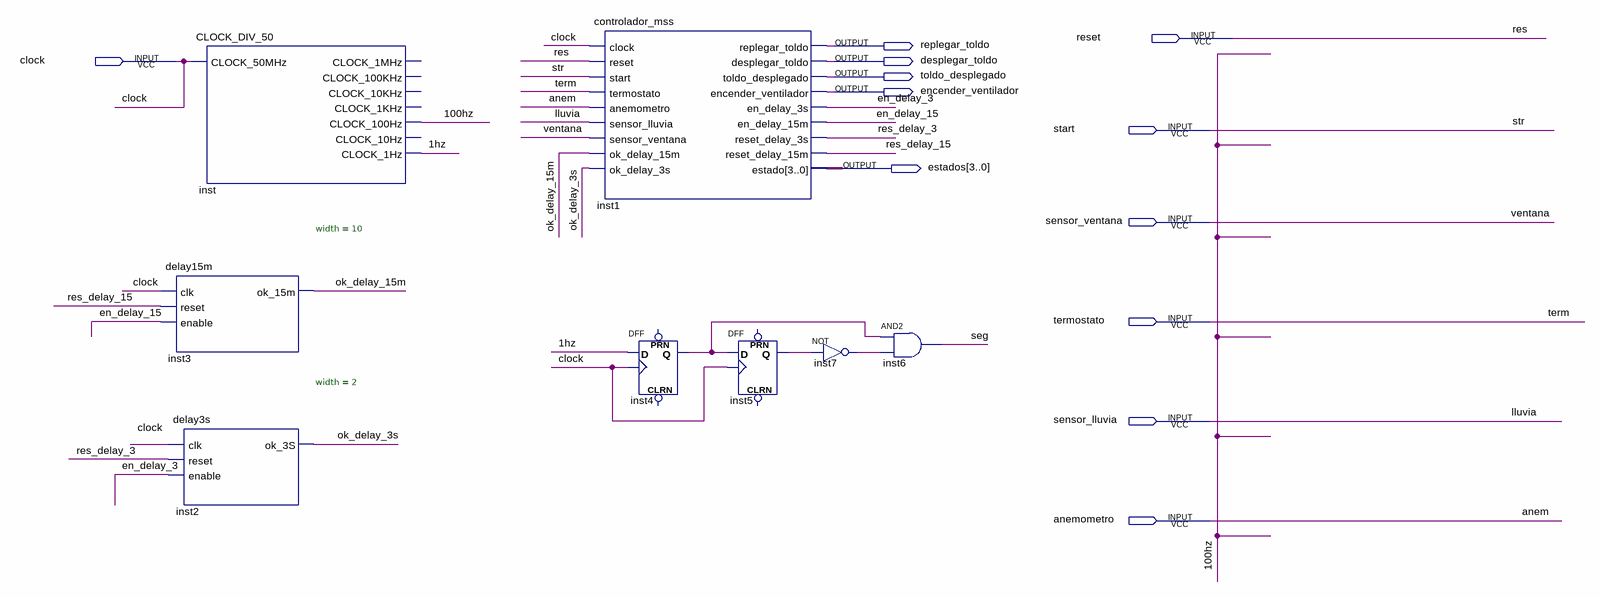
[diagram p0: schematic sheet]
// Quartus schematic domotico.bdf as structural Verilog: 8 symbols, 12 pins
module domotico (
  input  reset,
  input  clock,
  input  start,
  input  sensor_ventana,
  input  termostato,
  input  sensor_lluvia,
  input  anemometro,
  output replegar_toldo,
  output desplegar_toldo,
  output toldo_desplegado,
  output encender_ventilador,
  output [3:0] estados
);

  wire \1hz , \100hz , en_delay_3, en_delay_15, inst4_q, inst5_q, inst7_out, ok_delay_3s, ok_delay_15m,
       res_delay_3, res_delay_15, seg;

  CLOCK_DIV_50 inst (
    .CLOCK_50MHz(clock), .CLOCK_100Hz(\100hz ), .CLOCK_1Hz(\1hz ));  // open: CLOCK_1MHz, CLOCK_100KHz, CLOCK_10KHz, CLOCK_1KHz, CLOCK_10Hz
  delay15m #(.width(10)) inst3 (.clk(clock), .reset(res_delay_15), .enable(en_delay_15), .ok_15m(ok_delay_15m));
  delay3s #(.width(2)) inst2 (.clk(clock), .reset(res_delay_3), .enable(en_delay_3), .ok_3S(ok_delay_3s));
  controlador_mss inst1 (
    .clock(clock), .reset(reset), .start(start), .termostato(termostato), .anemometro(anemometro),
    .sensor_lluvia(sensor_lluvia), .sensor_ventana(sensor_ventana), .ok_delay_15m(ok_delay_15m),
    .ok_delay_3s(ok_delay_3s), .replegar_toldo(replegar_toldo), .desplegar_toldo(desplegar_toldo),
    .toldo_desplegado(toldo_desplegado), .encender_ventilador(encender_ventilador), .en_delay_3s(en_delay_3),
    .en_delay_15m(en_delay_15), .reset_delay_3s(res_delay_3), .reset_delay_15m(res_delay_15), .estado(estados));
  DFF inst4 (.CLK(clock), .D(\1hz ), .Q(inst4_q));  // open: CLRN, PRN
  DFF inst5 (.CLK(clock), .D(inst4_q), .Q(inst5_q));  // open: CLRN, PRN
  not inst7 (inst7_out, inst5_q);
  and inst6 (seg, inst4_q, inst7_out);

  // Other names for the same wires on the sheet: anem = anemometro; lluvia = sensor_lluvia; res = reset; str = start;
  //   term = termostato; ventana = sensor_ventana
endmodule
